# Altium schematic sheet Sheet4.SchDoc
size A
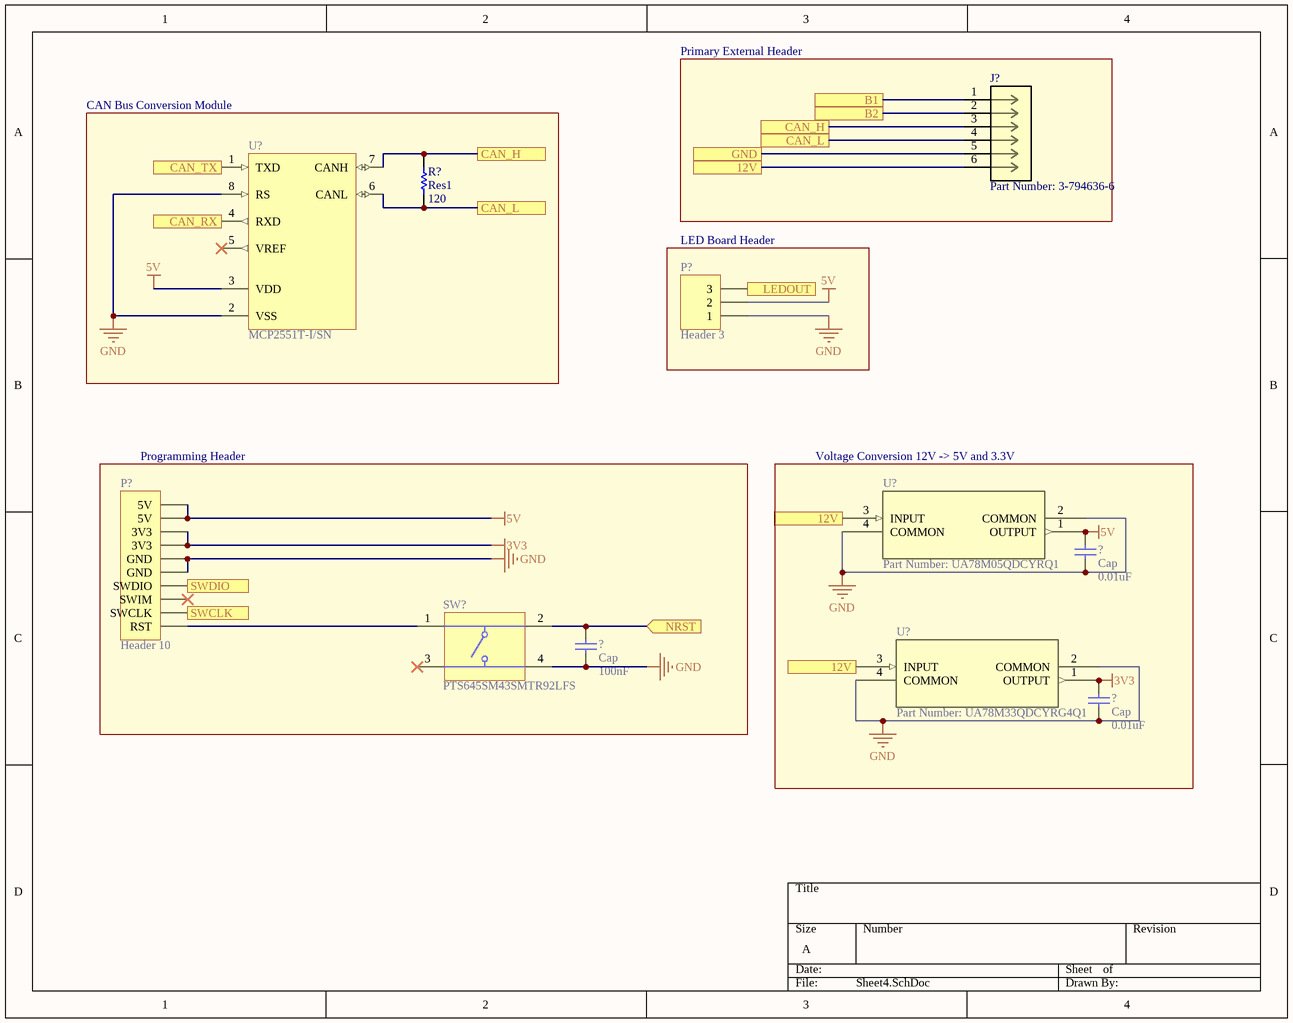
[diagram p0: Sheet4.SchDoc]

## Parts
(Parts that share a designator on the sheet are numbered #1, #2 ... from top to bottom, then left to right.)
?#1  Cap  value 0.01uF  [RAD-0.3]
?#2  Cap  value 100nF  [RAD-0.3]
?#3  Cap  value 0.01uF  [RAD-0.3]
J?  Part Number: 3-794636-6  [CON6_2X3_P3MM_VM]
P?#1  Header 3  [HDR1X3]
P?#2  Header 10  [HDR1X10]
R?  Res1  value 120  [AXIAL-0.3]
SW?  PTS645SM43SMTR92LFS  [ITT-PTS645S-4_V]
U?#1  MCP2551T-I/SN  [SOIC-SN8_L]
U?#2  Part Number: UA78M05QDCYRQ1  [DCY4]
U?#3  Part Number: UA78M33QDCYRG4Q1  [DCY4]

## Blocks framed on the sheet
Primary External Header: J?
CAN Bus Conversion Module: R? U?#1
LED Board Header: P?#1
Programming Header: ?#2 P?#2 SW?
Voltage Conversion 12V -> 5V and 3.3V: ?#1 ?#3 U?#2 U?#3

## Ports
12V, B1, B2, CAN_H, CAN_L, CAN_RX, CAN_TX, GND, LEDOUT, NRST (in), SWCLK (in), SWDIO (in)

## Nets
3V3: ?#3.1 P?#2.7(3V3) P?#2.8(3V3) U?#3.1(OUTPUT)
5V: ?#1.1 P?#1.2 P?#2.9(5V) P?#2.10(5V) U?#1.3(VDD) U?#2.1(OUTPUT)
GND: ?#1.2 ?#2.1 ?#3.2 P?#1.1 P?#2.5(GND) P?#2.6(GND) SW?.4 U?#1.2(VSS) U?#1.8(RS) U?#2.2(COMMON) U?#2.4(COMMON) U?#3.2(COMMON) U?#3.4(COMMON)
12V: J?.6 U?#2.3(INPUT) U?#3.3(INPUT) ; port 12V
B1: J?.1 ; port B1
B2: J?.2 ; port B2
CAN_H: J?.3 R?.2 U?#1.7(CANH) ; port CAN_H
CAN_L: J?.4 R?.1 U?#1.6(CANL) ; port CAN_L
CAN_RX: U?#1.4(RXD) ; port CAN_RX
CAN_TX: U?#1.1(TXD) ; port CAN_TX
GND: J?.5 ; port GND  [a separate net that carries the same name]
LEDOUT: P?#1.3 ; port LEDOUT
NRST: ?#2.2 SW?.2 ; port NRST
SWCLK: P?#2.2(SWCLK) ; port SWCLK
SWDIO: P?#2.4(SWDIO) ; port SWDIO
NetP?#2_1: P?#2.1(RST) SW?.1

Not connected (* = marked no-connect by the designer): P?#2 3(SWIM)*; SW? 3*; U?#1 5(VREF)*

## Library data of the parts
?#1-?#3 = Cap: Capacitor; Published: 8-Jun-2000; LatestRevisionDate: 17-Jul-2002; LatestRevisionNote: Re-released for DXP Platform.; PackageReference: RAD-0.3; Publisher: Altium Limited; PackageDescription: Radial Cap, Thru-Hole; 2 Leads; 0.3 in Pin Spacing
J? = 3-794636-6: No Description Available; Vendor: TE Connectivity; Built_By: EMA_UL_Team; Manufacturer_Part_Number: 3-794636-6; Copyright: Copyright (C) 2018 Accelerated Designs. All rights reserved; RefDes: RefDes; Type: DEV; Value: Value
P?#1 = Header 3: Header, 3-Pin; LatestRevisionDate: 17-Jul-2002; LatestRevisionNote: Re-released for DXP Platform.; Publisher: Altium Limited
P?#2 = Header 10: Header, 10-Pin; LatestRevisionDate: 17-Jul-2002; LatestRevisionNote: Re-released for DXP Platform.; Publisher: Altium Limited
R? = Res1: Resistor; Published: 8-Jun-2000; LatestRevisionDate: 17-Jul-2002; LatestRevisionNote: Re-released for DXP Platform.; PackageReference: AXIAL-0.3; Publisher: Altium Limited; PackageDescription: Axial Device, Thru-Hole; 2 Leads; 0.3 in Pin Spacing
SW? = CMP-2000-05160-1: 6 mm Tact Switche, SPST, NO, -20 to 60 degC, 4-Pin SMT, RoHS, Tape and Reel; Manufacturer: ITT Cannon; Manufacturer URL: http://www.ittcannon.com/; Datasheet Version: Feb-14; Datasheet URL: https://datasheet.ciiva.com/29903/getdatasheetpartid-786341-29903846.pdf
U?#1 = CMP-0186-00037-2: High-Speed CAN Transceiver, 8-Pin SOIC, Industrial Temperature, Tape and Reel; RevisionNote: URLs added. DatasheetVersion updated.; DatasheetVersion: revF, Jul-2010; PackageReference: SOIC-SN8; ComponentLink3URL: http://www.microchip.com/stellent/groups/techpub_sg/documents/packagingspec/en012702.pdf; Code_IPC: SOIC127P600-8; ComponentLink3Description: Package Specification; Code_JEDEC: MS-012; ComponentLink2Description: Datasheet; ComponentLink1URL: http://www.microchip.com/; PackageDescription: 8-Lead Plastic Small Outline (SN) - Narrow, 3.90mm Body [SOIC]; ComponentLink2URL: http://ww1.microchip.com/downloads/en/DeviceDoc/21667F.pdf; PackageVersion: revBB, Aug-2009; ComponentLink1Description: Manufacturer URL
U?#2 U?#3 = UA78M05QDCYRQ1: No Description Available; Vendor: Texas Instruments; Built_By: EMA_UL_Team; Manufacturer_Part_Number: UA78M05QDCYRQ1; Manufacturer: Texas Instruments; Copyright: Copyright (C) 2018 Accelerated Designs. All rights reserved; RefDes: RefDes; Type: DEV; Value: Value